# Altium schematic sheet Teensy.SchDoc
size A4; SheetNumber: 2; SheetTotal: 8
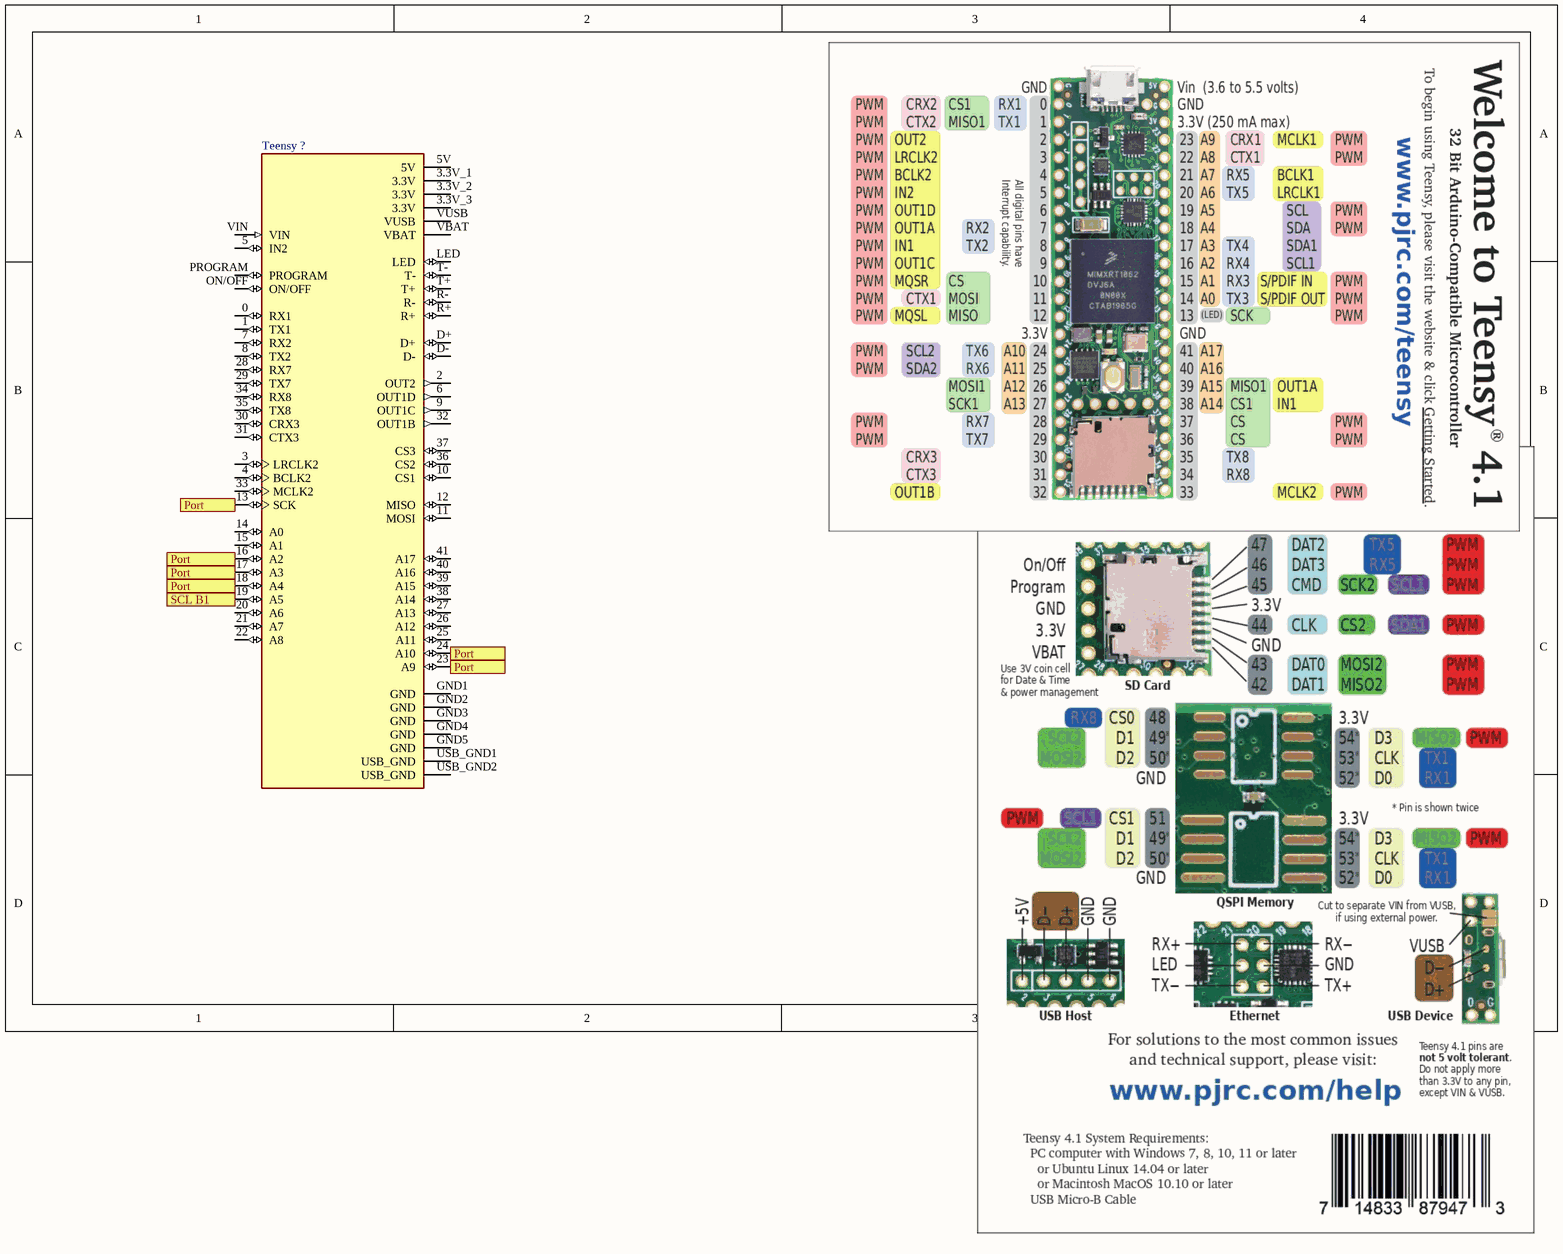
[diagram p0: Teensy.SchDoc]

## Parts
Teensy_?  Teensy 4.1  [MODULE_DEV-16771]  (value not drawn)

## Ports
Port, SCL B1

## Nets
Port: Teensy_?.13(SCK) Teensy_?.16(A2) Teensy_?.17(A3) Teensy_?.18(A4) Teensy_?.23(A9) Teensy_?.24(A10) ; port Port
SCL B1: Teensy_?.19(A5) ; port SCL B1

Not connected (* = marked no-connect by the designer): Teensy_? 0(RX1) 1(TX1) 2(OUT2) 3(LRCLK2) 3.3V_1(3.3V) 3.3V_2(3.3V) 3.3V_3(3.3V) 4(BCLK2) 5(IN2) 5V 6(OUT1D) 7(RX2) 8(TX2) 9(OUT1C) 10(CS1) 11(MOSI) 12(MISO) 14(A0) 15(A1) 20(A6) 21(A7) 22(A8) 25(A11) 26(A12) 27(A13) 28(RX7) 29(TX7) 30(CRX3) 31(CTX3) 32(OUT1B) 33(MCLK2) 34(RX8) 35(TX8) 36(CS2) 37(CS3) 38(A14) 39(A15) 40(A16) 41(A17) D+ D- GND1(GND) GND2(GND) GND3(GND) GND4(GND) GND5(GND) LED ON/OFF PROGRAM R+ R- T+ T- USB_GND1(USB_GND) USB_GND2(USB_GND) VBAT VIN VUSB

## Library data of the parts
Teensy_? = CMP-003-000000-1: RT1062 Teensy 4.1 series ARMÂ® CortexÂ®-M7 MPU Embedded Evaluation Board; MF: SparkFun Electronics; MP: DEV-16771; Package: None; Component Type: Standard; Pin Count: 65; Purchase-URL: https://pricing.snapeda.com/search/part/DEV-16771/?ref=eda; SnapEDA_Link: https://www.snapeda.com/parts/DEV-16771/SparkFun+Electronics/view-part/?ref=snap; Availability: In Stock; Source: DEV-16771.SchLib; Design Item ID: DEV-16771; Check_prices: https://www.snapeda.com/parts/DEV-16771/SparkFun+Electronics/view-part/?ref=eda; Value: *; Price: None